# EAGLE design AS504XX_BreakoutV4 (EAGLE 9.6.2)
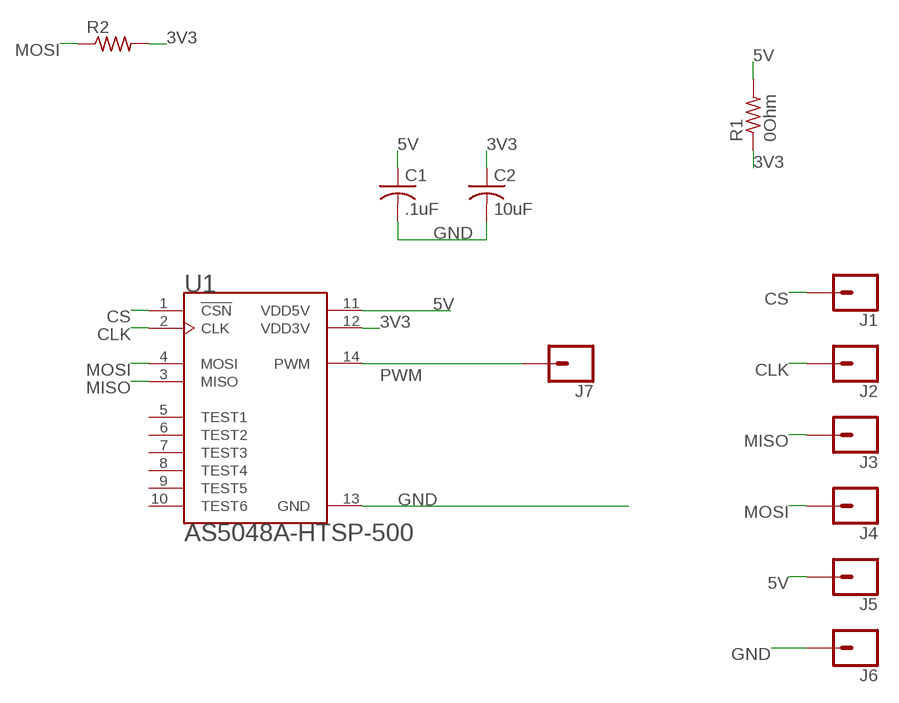
[diagram p0: schematic, sheet 1]

## Parts
C1  .1uF  C-USC0402  [C0402]
C2  10uF  C-USC0402  [C0402]
J1  CONN_01  [1X01]
J2  CONN_01  [1X01]
J3  CONN_01  [1X01]
J4  CONN_01  [1X01]
J5  CONN_01  [1X01]
J6  CONN_01  [1X01]
J7  CONN_01  [1X01]
R1  0Ohm  R-US_R0402  [R0402]
R2  R-US_R0603  [R0603]
U1  AS5048A-HTSP-500  [SOP65P640X120-14N]

## Nets
3V3: C2.1 R1.1 R2.2 U1.12(VDD3V)
5V: C1.1 J5.1 R1.2 U1.11(VDD5V)
CLK: J2.1 U1.2(CLK)
CS: J1.1 U1.1(!CSN)
GND: C1.2 C2.2 J6.1 U1.13(GND)
MISO: J3.1 U1.3(MISO)
MOSI: J4.1 R2.1 U1.4(MOSI)
PWM: J7.1 U1.14(PWM)
Unconnected: U1.5(TEST1) U1.6(TEST2) U1.7(TEST3) U1.8(TEST4) U1.9(TEST5) U1.10(TEST6)

## Library data of the parts
C1 C2 = adafruit:C-US: CAPACITOR, American symbol
J1-J7 = SparkFun-Connectors:CONN_01: Single connection point. Often used as Generic Header-pin footprint for 0.1 inch spaced/style header connections On any of the 0.1 inch spaced packages, you can populate with these: Break Away Headers - Straight <https://www.sparkfun.com/products/116> (PRT-00116) Break Away Male Headers - Right Angle <https://www.sparkfun.com/products/553> (PRT-00553) Female Headers <https://www.sparkfun.com/products/115> (PRT-00115) Break Away Headers - Machine Pin <https://www.sparkfun.com/products/117> (PRT-00117) Break Away Female Headers - Swiss Machine Pin <https://www.sparkfun.com/products/743> (PRT-00743) This device is also useful as a general connection point to wire up your design to another part of your project. Our various solder wires solder well into these plated through hole pads. Hook-Up Wire - Assortment (Stranded, 22 AWG) <https://www.sparkfun.com/products/11375> (PRT-11375) Hook-Up Wire - Assortment (Solid Core, 22 AWG) <https://www.sparkfun.com/products/11367> (PRT-11367) View the entire wire category on our website here <https://www.sparkfun.com/categories/141> Special notes: SMTSO-256-ET is a "flush mount" nut for a 4-40 screw. We mostly use this on specialty testbeds; it is a nice way to connect hardware to your PCB at an adjustable hieght. Also note, the SNAP packages are for using a snappable style connector. We sell a baggie of snaps and they are also used on two LilyPad designs: Snap Assortment - 30 pack (male and female) <https://www.sparkfun.com/products/11347> (DEV-11347) LilyPad Arduino SimpleSnap <https://www.sparkfun.com/products/10941> (DEV-10941) LilyPad SimpleSnap Protoboard <https://www.sparkfun.com/products/10940> (DEV-10940)
R1 = adafruit:R-US_: RESISTOR, American symbol
R2 = rcl:R-US_: RESISTOR, American symbol; SPICEPREFIX: R
U1 = AS5048A-HTSP-500:AS5048A-HTSP-500: AS5048B Series 360° 3.3 / 5 V 14 bit Magnetic Rotary Encoder - TSSOP-14; DESCRIPTION: Hall Effect Sensor Angle External Magnet, Not Included Gull Wing; DIGI-KEY_PART_NUMBER: AS5048A-HTSP-500CT-ND; MF: ams; MP: AS5048A-HTSP-500; PACKAGE: TSSOP-14 ams

## Board
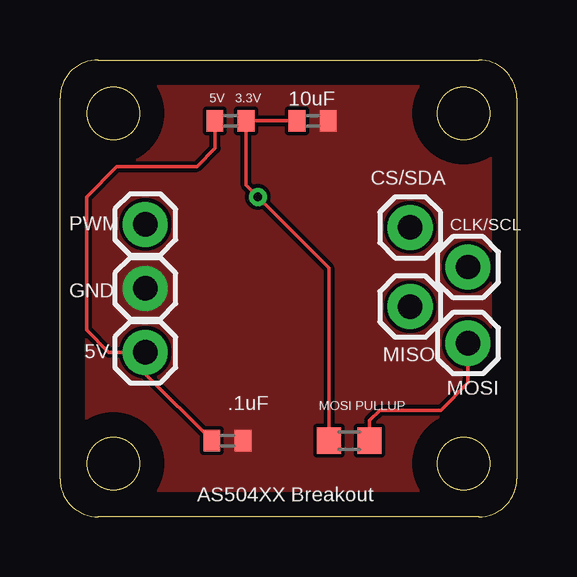
[diagram p1: board, top side]
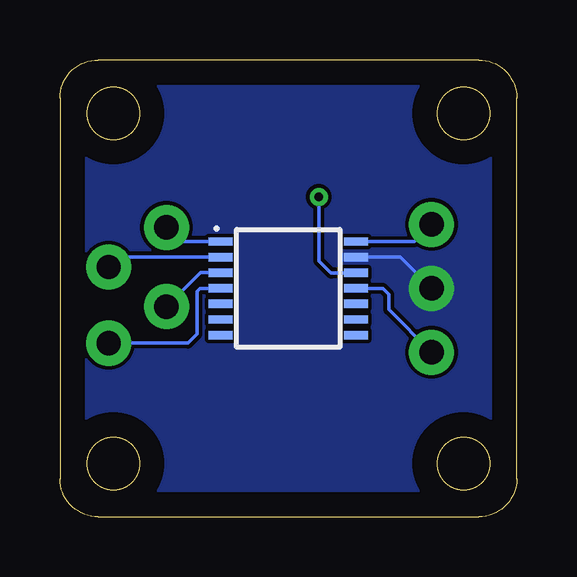
[diagram p2: board, bottom side, seen from below]

Size 19.05 x 19.05 mm. Coordinates in mm from the lower left corner, seen from the top.
Outline: 19.05,17.46 19.05,1.59 arc-90 17.46,0 1.59,0 arc-90 0,1.59 0,17.46 arc-90 1.59,19.05 17.46,19.05 arc-90 19.05,17.46
Outline: circle at 16.83,16.83 radius 1.1
Outline: circle at 2.22,2.22 radius 1.1
Outline: circle at 2.22,16.83 radius 1.1
Outline: circle at 16.83,2.22 radius 1.1
Copper layers (1*16): Top 0.035mm / dielectric 1.5mm / Bottom 0.035mm
Design rules "default": minimum track width 6mil, minimum drill 0.35mm, track to track 6mil, track to pad 6mil, pad to pad 6mil, via to via 6mil, smd to smd 6mil, copper to edge 40mil, drill to drill 6mil, minimum pad ring 10mil, minimum via ring 8mil, stop-mask expansion 4mil, vias tented up to drill 0mil, thermal gap 10mil

### Footprints (pad centres in the part's own frame; a part is rotated, then mirrored left to right if it is on the bottom)
C0402 = smd 0.7 x 0.9: 1 -0.65,0; 2 0.65,0
1X01 = drill 1.016 pad 1.88: 1 0,0
R0402 = smd 0.7 x 0.9: 1 -0.65,0; 2 0.65,0
R0603 = smd 1 x 1.1: 1 -0.85,0; 2 0.85,0
SOP65P640X120-14N = smd 1 x 0.35: 1 -2.825,1.95; 2 -2.825,1.3; 3 -2.825,0.65; 4 -2.825,0; 5 -2.825,-0.65; 6 -2.825,-1.3; 7 -2.825,-1.95; 8 2.825,-1.95; 9 2.825,-1.3; 10 2.825,-0.65; 11 2.825,0; 12 2.825,0.65; 13 2.825,1.3; 14 2.825,1.95

### Placement (x,y rotation side)
C1  6.99,3.18 0 top
C2  10.54,16.51 0 top
J1  14.61,12.07 0 top
J2  17.02,10.41 0 top
J3  14.61,8.76 0 top
J4  17.02,7.24 0 top
J5  3.56,6.86 0 top
J6  3.56,9.53 0 top
J7  3.56,12.19 0 top
R1  7.11,16.51 180 top
R2  12.07,3.18 180 top
U1  9.53,9.53 0 bottom

### Tracks (layer width: path | path; a pad name or v marks a point on that pad's centre or on a via)
3V3  (via drill 0.35)
  Top 0.152: C2.1 R1.1 7.76,13.83 v8.26,13.34 11.22,10.38 R2.2
  Bottom 0.152: U1.12 6.72,10.16 7.75,10.16 8.26,10.67 v8.26,13.34
5V
  Top 0.152: R1.2 6.48,16.5 6.48,15.37 5.72,14.61 2.38,14.61 1.11,13.34 1.11,7.79 2.03,6.86 J5.1 3.56,5.95 C1.1
  Bottom 0.152: J5.1 5.33,8.64 5.33,9.27 5.59,9.53 U1.11
CLK
  Bottom 0.152: U1.2 16.61,10.83 J2.1
CS
  Bottom 0.152: U1.1 14.02,11.48 J1.1
GND
  Bottom 0.152: J6.1 4.86,10.83 U1.13
  pour Bottom (no thermals): 0.64,18.42 0.64,0.64 18.42,0.64 18.42,18.42
  pour Top (no thermals): 0.64,18.42 0.64,0.64 18.42,0.64 18.42,18.42
MISO
  Bottom 0.152: U1.3 13.19,10.18 J3.1
MOSI
  Top 0.152: J4.1 17.02,5.59 15.88,4.45 13.34,4.45 12.92,4.03 R2.1
  Bottom 0.152: J4.1 13.72,7.24 13.34,7.62 13.34,9.4 13.21,9.53 U1.4
PWM
  Bottom 0.152: U1.14 4.27,11.48 J7.1

### Text on the board
tPlace: 5V 3.3V | 10uF | CS/SDA | PWM | CLK/SCL | GND | 5V | MISO | MOSI | .1uF | MOSI PULLUP | AS504XX Breakout